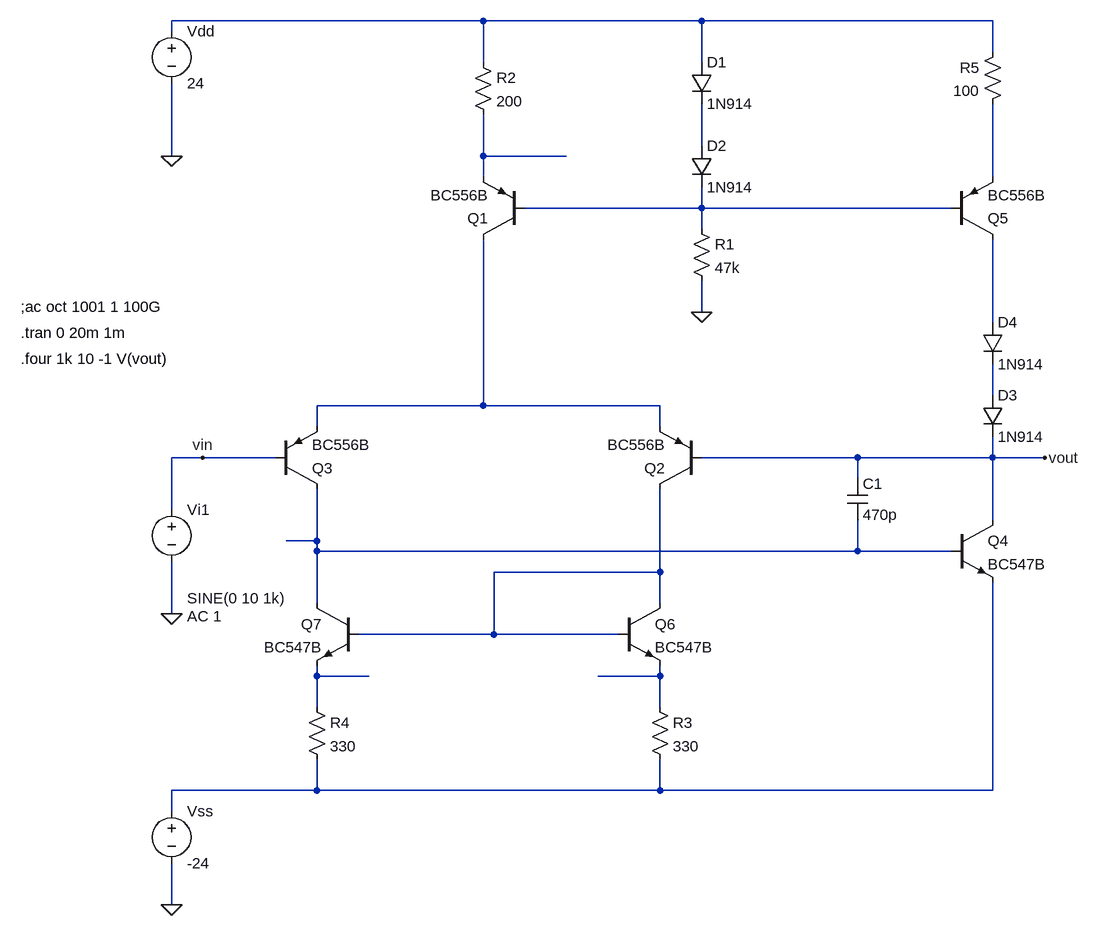
[diagram p0: schematic input_stage+vas_tb.asc]
input_stage+vas_tb.asc, the LTspice schematic file:
Version 4
SHEET 1 3384 968
WIRE 176 -672 -304 -672
WIRE 512 -672 176 -672
WIRE 960 -672 512 -672
WIRE -304 -656 -304 -672
WIRE 960 -624 960 -672
WIRE 176 -608 176 -672
WIRE 512 -608 512 -672
WIRE 512 -480 512 -544
WIRE -304 -464 -304 -576
WIRE 176 -464 176 -528
WIRE 304 -464 176 -464
WIRE 176 -432 176 -464
WIRE 960 -432 960 -544
WIRE 512 -384 512 -416
WIRE 512 -384 240 -384
WIRE 896 -384 512 -384
WIRE 512 -352 512 -384
WIRE 512 -224 512 -272
WIRE 960 -208 960 -336
WIRE 960 -96 960 -144
WIRE 176 -80 176 -336
WIRE 176 -80 -80 -80
WIRE 448 -80 176 -80
WIRE -80 -48 -80 -80
WIRE 448 -48 448 -80
WIRE -256 0 -304 0
WIRE -144 0 -256 0
WIRE 752 0 512 0
WIRE 960 0 960 -32
WIRE 960 0 752 0
WIRE 1040 0 960 0
WIRE 752 32 752 0
WIRE -304 80 -304 0
WIRE 960 96 960 0
WIRE -80 128 -80 48
WIRE -80 128 -128 128
WIRE -80 144 -80 128
WIRE 752 144 752 96
WIRE 752 144 -80 144
WIRE 896 144 752 144
WIRE 448 176 448 48
WIRE 448 176 192 176
WIRE -80 224 -80 144
WIRE 448 224 448 176
WIRE -304 240 -304 160
WIRE 192 272 192 176
WIRE 192 272 -16 272
WIRE 384 272 192 272
WIRE -80 336 -80 320
WIRE 0 336 -80 336
WIRE 448 336 448 320
WIRE 448 336 352 336
WIRE -80 384 -80 336
WIRE 448 384 448 336
WIRE -80 512 -80 464
WIRE -80 512 -304 512
WIRE 448 512 448 464
WIRE 448 512 -80 512
WIRE 960 512 960 192
WIRE 960 512 448 512
WIRE -304 544 -304 512
WIRE -304 688 -304 624
FLAG -304 240 0
FLAG -256 0 vin
FLAG -304 688 0
FLAG -304 -464 0
FLAG 512 -224 0
FLAG 1040 0 vout
DATAFLAG -112 128 ""
DATAFLAG 304 -80 ""
DATAFLAG 288 -464 ""
DATAFLAG 672 0 ""
DATAFLAG 576 144 ""
DATAFLAG 768 -384 ""
DATAFLAG 0 336 ""
DATAFLAG 352 336 ""
SYMBOL diode 496 -608 R0
SYMATTR InstName D1
SYMATTR Value 1N914
SYMBOL diode 496 -480 R0
SYMATTR InstName D2
SYMATTR Value 1N914
SYMBOL res 496 -368 R0
SYMATTR InstName R1
SYMATTR Value 47k
SYMBOL pnp 240 -336 R180
SYMATTR InstName Q1
SYMATTR Value BC556B
SYMBOL res 160 -624 R0
SYMATTR InstName R2
SYMATTR Value 200
SYMBOL pnp 512 48 R180
SYMATTR InstName Q2
SYMATTR Value BC556B
SYMBOL pnp -144 48 M180
SYMATTR InstName Q3
SYMATTR Value BC556B
SYMBOL voltage -304 528 R0
WINDOW 123 24 124 Left 2
WINDOW 39 0 0 Left 0
SYMATTR InstName Vss
SYMATTR Value -24
SYMBOL voltage -304 -672 R0
WINDOW 123 24 44 Left 2
WINDOW 39 0 0 Left 0
SYMATTR InstName Vdd
SYMATTR Value 24
SYMBOL voltage -304 64 R0
WINDOW 123 24 180 Left 2
WINDOW 39 0 0 Left 0
WINDOW 3 24 152 Left 2
SYMATTR Value2 AC 1
SYMATTR InstName Vi1
SYMATTR Value SINE(0 10 1k)
SYMBOL npn 896 96 R0
SYMATTR InstName Q4
SYMATTR Value BC547B
SYMBOL pnp 896 -336 M180
SYMATTR InstName Q5
SYMATTR Value BC556B
SYMBOL res 976 -640 M0
SYMATTR InstName R5
SYMATTR Value 100
SYMBOL diode 944 -96 R0
SYMATTR InstName D3
SYMATTR Value 1N914
SYMBOL diode 944 -208 R0
SYMATTR InstName D4
SYMATTR Value 1N914
SYMBOL cap 736 32 R0
SYMATTR InstName C1
SYMATTR Value 470p
SYMBOL npn 384 224 R0
SYMATTR InstName Q6
SYMATTR Value BC547B
SYMBOL npn -16 224 M0
SYMATTR InstName Q7
SYMATTR Value BC547B
SYMBOL res 432 368 R0
SYMATTR InstName R3
SYMATTR Value 330
SYMBOL res -96 368 R0
SYMATTR InstName R4
SYMATTR Value 330
TEXT -536 -232 Left 2 !;ac oct 1001 1 100G
TEXT -536 -192 Left 2 !.tran 0 20m 1m
TEXT -536 -152 Left 2 !.four 1k 10 -1 V(vout)

The netlist it stands for:
* input_stage+vas_tb.asc
D1 N001 N002 1N914
D2 N002 N005 1N914
R1 N005 0 47k
Q1 N008 N005 N003 0 BC556B
R2 N001 N003 200
Q2 N010 vout N008 0 BC556B
Q3 N009 vin N008 0 BC556B
Vss N013 0 -24
Vdd N001 0 24
Vi1 vin 0 SINE(0 10 1k) AC 1
Q4 vout N009 N013 0 BC547B
Q5 N006 N005 N004 0 BC556B
R5 N001 N004 100
D3 N007 vout 1N914
D4 N006 N007 1N914
C1 vout N009 470p
Q6 N010 N010 N012 0 BC547B
Q7 N009 N010 N011 0 BC547B
R3 N012 N013 330
R4 N011 N013 330
.model D D
.lib standard.dio
.model NPN NPN
.model PNP PNP
.lib standard.bjt
;ac oct 1001 1 100G
.tran 0 20m 1m
.four 1k 10 -1 V(vout)
.backanno
.end